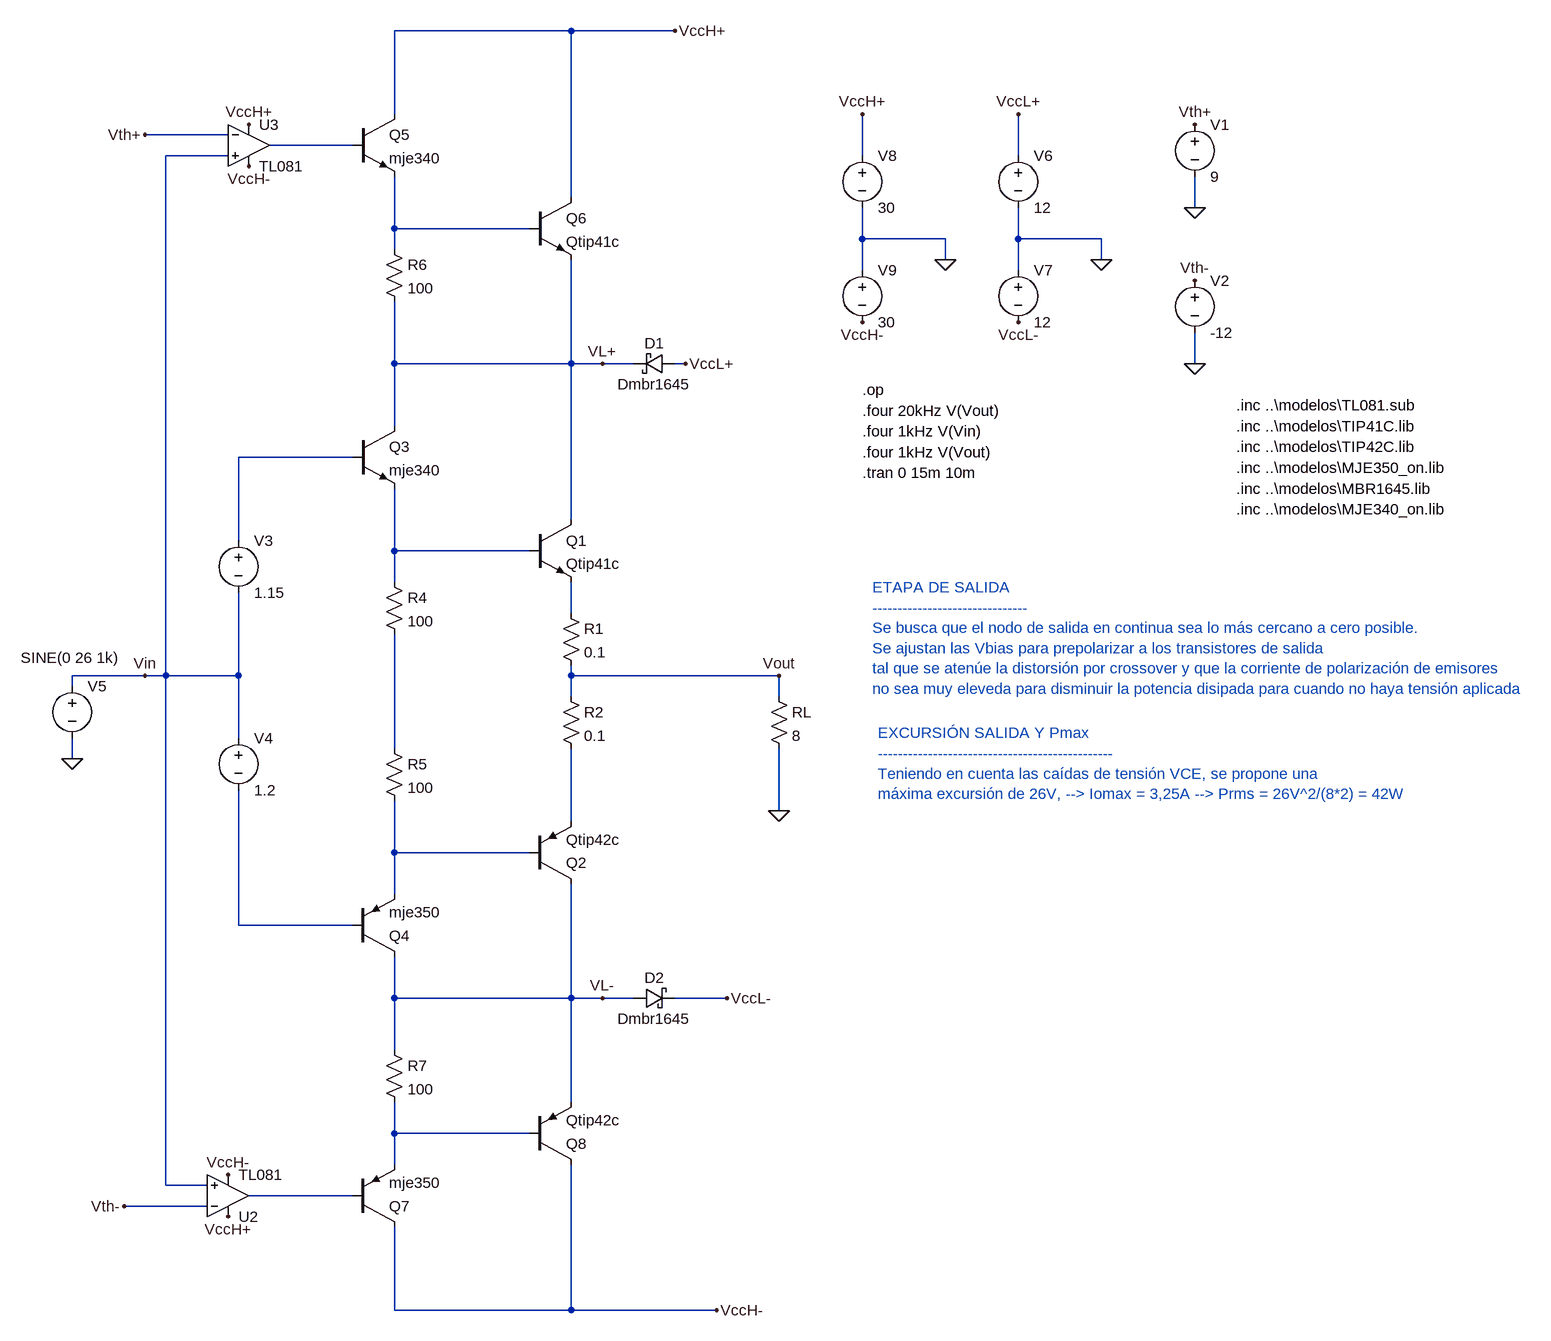
[diagram p0: schematic 1.0_salida.asc]
1.0_salida.asc, the LTspice schematic file:
Version 4
SHEET 1 1772 1428
WIRE 240 -720 -32 -720
WIRE 400 -720 240 -720
WIRE -32 -592 -32 -720
WIRE -288 -560 -416 -560
WIRE -96 -544 -224 -544
WIRE -288 -528 -384 -528
WIRE 688 -528 688 -592
WIRE 928 -528 928 -592
WIRE 240 -464 240 -720
WIRE 1200 -448 1200 -496
WIRE -32 -416 -32 -496
WIRE 176 -416 -32 -416
WIRE 688 -400 688 -448
WIRE 816 -400 688 -400
WIRE 928 -400 928 -448
WIRE 1056 -400 928 -400
WIRE -32 -384 -32 -416
WIRE 816 -368 816 -400
WIRE 1056 -368 1056 -400
WIRE 688 -352 688 -400
WIRE 928 -352 928 -400
WIRE -32 -208 -32 -304
WIRE 240 -208 240 -368
WIRE 240 -208 -32 -208
WIRE 288 -208 240 -208
WIRE 336 -208 288 -208
WIRE 416 -208 400 -208
WIRE 1200 -208 1200 -256
WIRE -32 -112 -32 -208
WIRE -96 -64 -272 -64
WIRE 240 32 240 -208
WIRE -272 64 -272 -64
WIRE -32 80 -32 -16
WIRE 176 80 -32 80
WIRE -32 128 -32 80
WIRE 240 176 240 128
WIRE -416 272 -528 272
WIRE -384 272 -384 -528
WIRE -384 272 -416 272
WIRE -272 272 -272 144
WIRE -272 272 -384 272
WIRE 240 272 240 256
WIRE 560 272 240 272
WIRE -528 288 -528 272
WIRE 240 304 240 272
WIRE 560 304 560 272
WIRE -272 368 -272 272
WIRE -32 384 -32 208
WIRE -528 400 -528 368
WIRE 560 480 560 384
WIRE 240 496 240 384
WIRE -32 544 -32 464
WIRE 176 544 -32 544
WIRE -32 608 -32 544
WIRE -272 656 -272 448
WIRE -96 656 -272 656
WIRE -32 768 -32 704
WIRE 240 768 240 592
WIRE 240 768 -32 768
WIRE 288 768 240 768
WIRE 336 768 288 768
WIRE 480 768 400 768
WIRE -32 848 -32 768
WIRE 240 928 240 768
WIRE -32 976 -32 928
WIRE 176 976 -32 976
WIRE -32 1024 -32 976
WIRE -384 1056 -384 272
WIRE -320 1056 -384 1056
WIRE -96 1072 -256 1072
WIRE -320 1088 -448 1088
WIRE -32 1248 -32 1120
WIRE 240 1248 240 1024
WIRE 240 1248 -32 1248
WIRE 464 1248 240 1248
FLAG 560 480 0
FLAG -528 400 0
FLAG 560 272 Vout
FLAG -416 272 Vin
FLAG 816 -368 0
FLAG 688 -592 VccH+
FLAG 688 -272 VccH-
FLAG 400 -720 VccH+
FLAG 464 1248 VccH-
FLAG 1056 -368 0
FLAG 928 -592 VccL+
FLAG 928 -272 VccL-
FLAG 416 -208 VccL+
FLAG 480 768 VccL-
FLAG -256 -576 VccH+
FLAG -256 -512 VccH-
FLAG -416 -560 Vth+
FLAG -288 1104 VccH+
FLAG -288 1040 VccH-
FLAG -448 1088 Vth-
FLAG 1200 -448 0
FLAG 1200 -576 Vth+
FLAG 1200 -208 0
FLAG 1200 -336 Vth-
FLAG 288 768 VL-
FLAG 288 -208 VL+
DATAFLAG 128 -208 ""
DATAFLAG 128 768 ""
DATAFLAG 336 272 "round(V(vout)*10k)/10k"
DATAFLAG 48 -416 ""
DATAFLAG -160 -544 ""
DATAFLAG 240 160 "round(I(R1)*10k)/10k"
DATAFLAG 240 464 "round(I(R2)*10k)/10k"
SYMBOL npn 176 32 R0
SYMATTR InstName Q1
SYMATTR Value Qtip41c
SYMBOL npn -96 -112 R0
SYMATTR InstName Q3
SYMATTR Value mje340
SYMBOL pnp 176 592 M180
SYMATTR InstName Q2
SYMATTR Value Qtip42c
SYMBOL res 224 160 R0
SYMATTR InstName R1
SYMATTR Value 0.1
SYMBOL res 224 288 R0
SYMATTR InstName R2
SYMATTR Value 0.1
SYMBOL res 544 288 R0
SYMATTR InstName RL
SYMATTR Value 8
SYMBOL pnp -96 704 M180
SYMATTR InstName Q4
SYMATTR Value mje350
SYMBOL res -48 112 R0
SYMATTR InstName R4
SYMATTR Value 100
SYMBOL res -48 368 R0
SYMATTR InstName R5
SYMATTR Value 100
SYMBOL voltage -272 48 R0
WINDOW 123 0 0 Left 2
WINDOW 39 0 0 Left 2
SYMATTR InstName V3
SYMATTR Value 1.15
SYMBOL voltage -272 352 R0
SYMATTR InstName V4
SYMATTR Value 1.2
SYMBOL voltage -528 272 R0
WINDOW 3 -79 -28 Left 2
WINDOW 123 0 0 Left 2
WINDOW 39 0 0 Left 2
SYMATTR Value SINE(0 26 1k)
SYMATTR InstName V5
SYMBOL res -48 -400 R0
SYMATTR InstName R6
SYMATTR Value 100
SYMBOL npn -96 -592 R0
SYMATTR InstName Q5
SYMATTR Value mje340
SYMBOL npn 176 -464 R0
SYMATTR InstName Q6
SYMATTR Value Qtip41c
SYMBOL schottky 400 -224 R90
WINDOW 0 0 32 VBottom 2
WINDOW 3 32 32 VTop 2
SYMATTR InstName D1
SYMATTR Value Dmbr1645
SYMBOL schottky 336 784 R270
WINDOW 0 32 32 VTop 2
WINDOW 3 0 32 VBottom 2
SYMATTR InstName D2
SYMATTR Value Dmbr1645
SYMBOL pnp 176 1024 M180
SYMATTR InstName Q8
SYMATTR Value Qtip42c
SYMBOL pnp -96 1120 M180
SYMATTR InstName Q7
SYMATTR Value mje350
SYMBOL res -48 832 R0
SYMATTR InstName R7
SYMATTR Value 100
SYMBOL voltage 688 -544 R0
WINDOW 123 0 0 Left 2
WINDOW 39 0 0 Left 2
SYMATTR InstName V8
SYMATTR Value 30
SYMBOL voltage 688 -368 R0
WINDOW 123 0 0 Left 2
WINDOW 39 0 0 Left 2
SYMATTR InstName V9
SYMATTR Value 30
SYMBOL voltage 928 -544 R0
WINDOW 123 0 0 Left 2
WINDOW 39 0 0 Left 2
SYMATTR InstName V6
SYMATTR Value 12
SYMBOL voltage 928 -368 R0
WINDOW 123 0 0 Left 2
WINDOW 39 0 0 Left 2
SYMATTR InstName V7
SYMATTR Value 12
SYMBOL Opamps\\opamp2 -288 1136 M180
SYMATTR InstName U2
SYMATTR Value TL081
SYMBOL voltage 1200 -592 R0
WINDOW 123 0 0 Left 2
WINDOW 39 0 0 Left 2
SYMATTR InstName V1
SYMATTR Value 9
SYMBOL voltage 1200 -352 R0
WINDOW 123 0 0 Left 2
WINDOW 39 0 0 Left 2
SYMATTR InstName V2
SYMATTR Value -12
SYMBOL Opamps\\opamp2 -256 -608 R0
SYMATTR InstName U3
SYMATTR Value TL081
TEXT 688 -40 Left 2 !.tran 0 15m 10m
TEXT 688 -104 Left 2 !.four 1kHz V(Vin)
TEXT 688 -136 Left 2 !.four 20kHz V(Vout)
TEXT 1264 -144 Left 2 !.inc ..\\modelos\\TL081.sub
TEXT 1264 -112 Left 2 !.inc ..\\modelos\\TIP41C.lib
TEXT 1264 -80 Left 2 !.inc ..\\modelos\\TIP42C.lib
TEXT 688 -168 Left 2 !.op
TEXT 1264 16 Left 2 !.inc ..\\modelos\\MJE340_on.lib
TEXT 1264 -48 Left 2 !.inc ..\\modelos\\MJE350_on.lib
TEXT 1264 -16 Left 2 !.inc ..\\modelos\\MBR1645.lib
TEXT 688 -72 Left 2 !.four 1kHz V(Vout)
TEXT 704 136 Left 2 ;ETAPA DE SALIDA\n-------------------------------\nSe busca que el nodo de salida en continua sea lo más cercano a cero posible.\nSe ajustan las Vbias para prepolarizar a los transistores de salida \ntal que se atenúe la distorsión por crossover y que la corriente de polarización de emisores\nno sea muy eleveda para disminuir la potencia disipada para cuando no haya tensión aplicada
TEXT 712 360 Left 2 ;EXCURSIÓN SALIDA Y Pmax\n-----------------------------------------------\nTeniendo en cuenta las caídas de tensión VCE, se propone una\nmáxima excursión de 26V, --> Iomax = 3,25A --> Prms = 26V^2/(8*2) = 42W

The netlist it stands for:
* 1.0_salida.asc
Q1 VL+ N004 N005 0 Qtip41c
Q3 VL+ N003 N004 0 mje340
Q2 VL- N008 N007 0 Qtip42c
R1 N005 Vout 0.1
R2 Vout N007 0.1
RL Vout 0 8
Q4 VL- N009 N008 0 mje350
R4 N004 N006 100
R5 N006 N008 100
V3 N003 Vin 1.15
V4 Vin N009 1.2
V5 Vin 0 SINE(0 26 1k)
R6 N002 VL+ 100
Q5 VccH+ N001 N002 0 mje340
Q6 VccH+ N002 VL+ 0 Qtip41c
D1 VccL+ VL+ Dmbr1645
D2 VL- VccL- Dmbr1645
Q8 VccH- N010 VL- 0 Qtip42c
Q7 VccH- N011 N010 0 mje350
R7 VL- N010 100
V8 VccH+ 0 30
V9 0 VccH- 30
V6 VccL+ 0 12
V7 0 VccL- 12
XU2 Vin Vth- VccH+ VccH- N011 TL081  ; pins In+ In- V+ V- OUT
V1 Vth+ 0 9
V2 Vth- 0 -12
XU3 Vin Vth+ VccH+ VccH- N001 TL081  ; pins In+ In- V+ V- OUT
.model D D
.lib standard.dio
.model NPN NPN
.model PNP PNP
.lib standard.bjt
.tran 0 15m 10m
.four 1kHz V(Vin)
.four 20kHz V(Vout)
.inc ..\modelos\TL081.sub
.inc ..\modelos\TIP41C.lib
.inc ..\modelos\TIP42C.lib
.op
.inc ..\modelos\MJE340_on.lib
.inc ..\modelos\MJE350_on.lib
.inc ..\modelos\MBR1645.lib
.four 1kHz V(Vout)
* ETAPA DE SALIDA
* -------------------------------
* Se busca que el nodo de salida en continua sea lo más cercano a cero posible.
* Se ajustan las Vbias para prepolarizar a los transistores de salida
* tal que se atenúe la distorsión por crossover y que la corriente de polarización de emisores
* no sea muy eleveda para disminuir la potencia disipada para cuando no haya tensión aplicada
* EXCURSIÓN SALIDA Y Pmax
* -----------------------------------------------
* Teniendo en cuenta las caídas de tensión VCE, se propone una
* máxima excursión de 26V, --> Iomax = 3,25A --> Prms = 26V^2/(8*2) = 42W
.backanno
.end